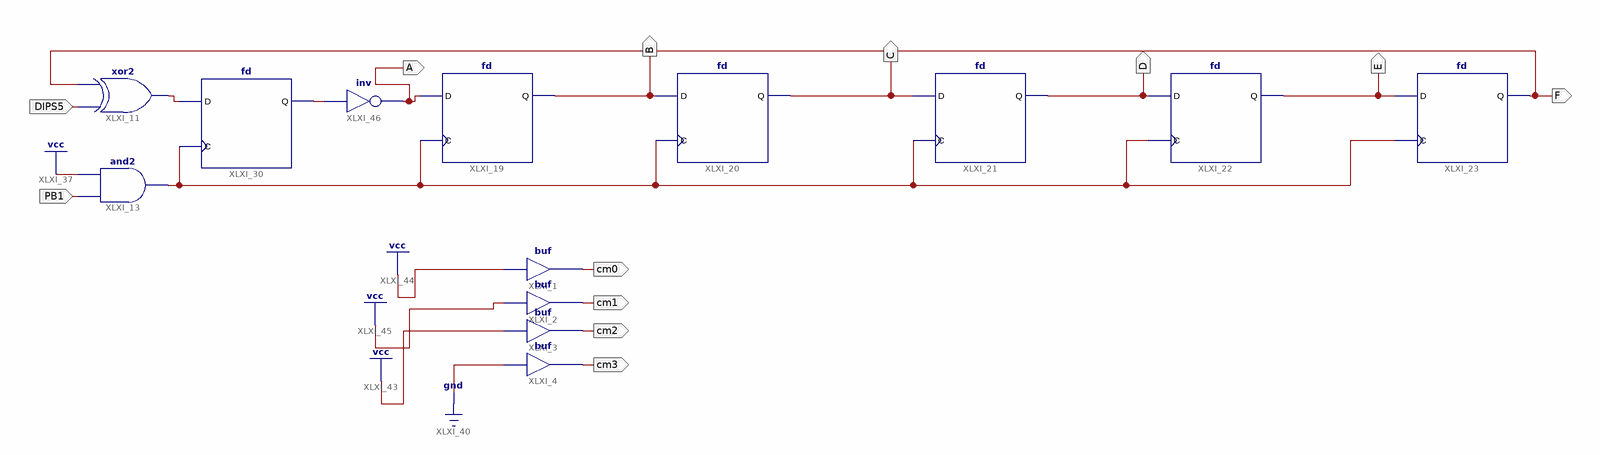
[diagram p0: schematic sheet 1]
// Xilinx ISE schematic lab7t.sch (spartan6) as structural Verilog: 13 symbols, 12 ports
module lab7t (
  input  DIPS5,
  input  PB1,
  output B,
  output C,
  output D,
  output E,
  output F,
  output cm0,
  output cm1,
  output cm2,
  output cm3,
  output A
);

  wire XLXN_29, XLXN_41, XLXN_87;

  buf XLXI_1 (cm0, 1'b1);
  buf XLXI_2 (cm1, 1'b1);
  buf XLXI_3 (cm2, 1'b1);
  buf XLXI_4 (cm3, 1'b0);
  fd XLXI_22 (.C(XLXN_41), .D(D), .Q(E));
  fd XLXI_20 (.C(XLXN_41), .D(B), .Q(C));
  fd XLXI_21 (.C(XLXN_41), .D(C), .Q(D));
  fd XLXI_23 (.C(XLXN_41), .D(E), .Q(F));
  fd XLXI_30 (.C(XLXN_41), .D(XLXN_29), .Q(XLXN_87));
  xor XLXI_11 (XLXN_29, DIPS5, F);
  fd XLXI_19 (.C(XLXN_41), .D(A), .Q(B));
  and XLXI_13 (XLXN_41, PB1, 1'b1);
  not XLXI_46 (A, XLXN_87);
endmodule
